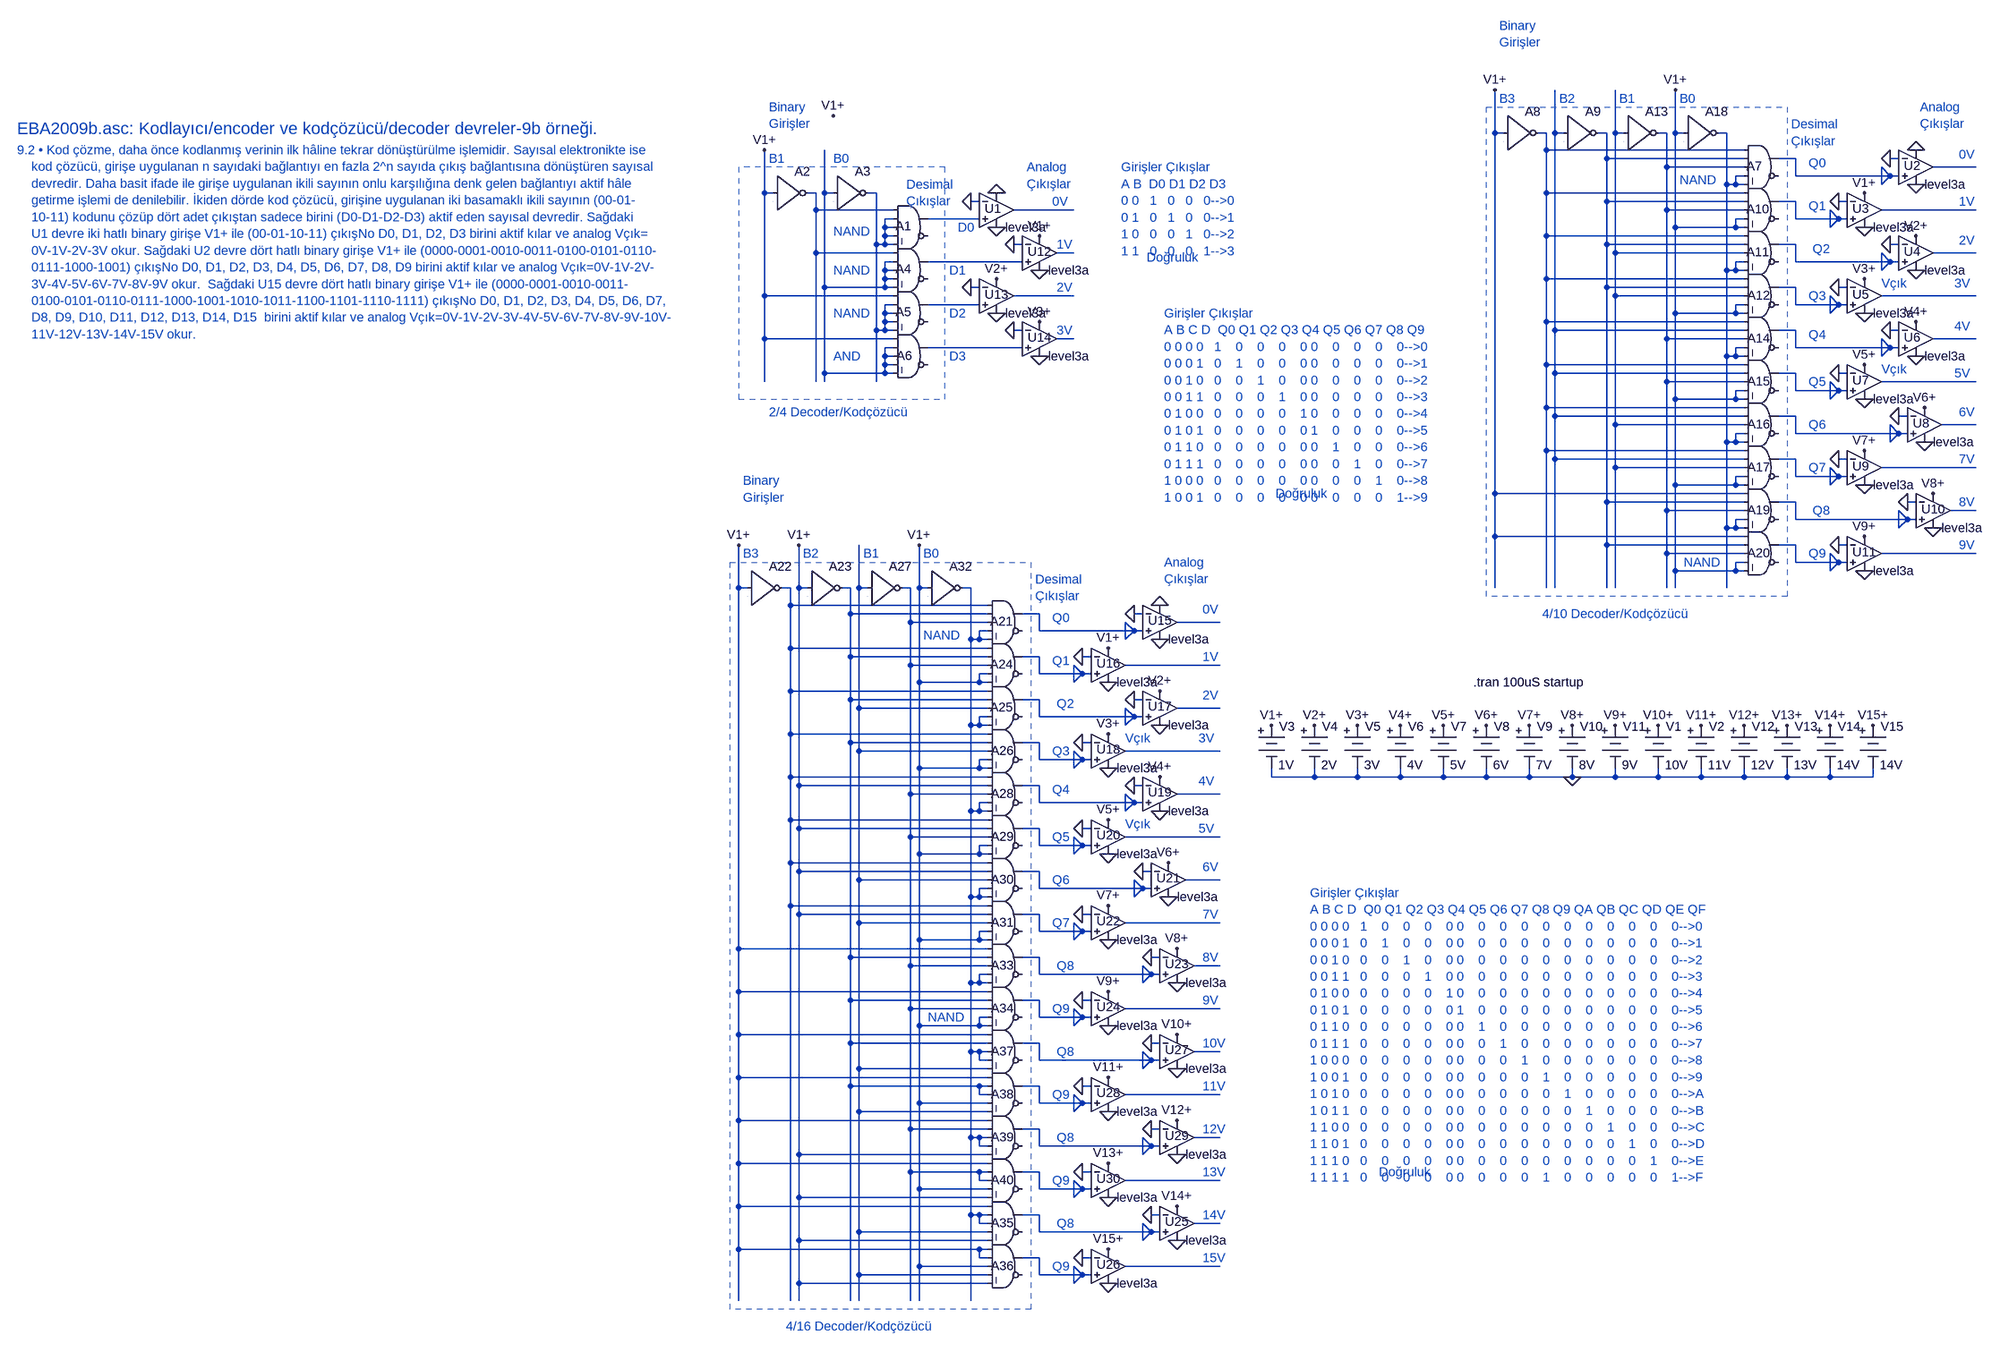
[diagram p0: schematic EBA2009b.asc]
EBA2009b.asc, the LTspice schematic file:
Version 4
SHEET 1 7064 4332
WIRE 2768 64 2768 -16
WIRE 2784 64 2768 64
WIRE 2864 64 2848 64
WIRE 2880 64 2880 -16
WIRE 2896 64 2880 64
WIRE 2976 64 2960 64
WIRE 2992 64 2992 -16
WIRE 3008 64 2992 64
WIRE 3088 64 3072 64
WIRE 3104 64 3104 -16
WIRE 3120 64 3104 64
WIRE 3200 64 3184 64
WIRE 2864 96 2864 64
WIRE 3232 96 2864 96
WIRE 2976 112 2976 64
WIRE 3232 112 2976 112
WIRE 3328 112 3296 112
WIRE 3520 112 3504 112
WIRE 3088 128 3088 64
WIRE 3232 128 3088 128
WIRE 3664 128 3584 128
WIRE 3232 144 3216 144
WIRE 3328 144 3328 112
WIRE 3504 144 3488 128
WIRE 3504 144 3328 144
WIRE 3520 144 3504 144
WIRE 3200 160 3200 64
WIRE 3216 160 3216 144
WIRE 3216 160 3200 160
WIRE 3232 160 3216 160
WIRE 3488 160 3488 128
WIRE 3488 160 3504 144
WIRE 1408 176 1408 96
WIRE 1424 176 1408 176
WIRE 1504 176 1488 176
WIRE 1520 176 1520 96
WIRE 1536 176 1520 176
WIRE 1616 176 1600 176
WIRE 2864 176 2864 96
WIRE 3232 176 2864 176
WIRE 1808 192 1792 192
WIRE 2976 192 2976 112
WIRE 3232 192 2976 192
WIRE 3328 192 3296 192
WIRE 3424 192 3408 192
WIRE 1504 208 1504 176
WIRE 1648 208 1504 208
WIRE 1984 208 1872 208
WIRE 3088 208 3088 128
WIRE 3232 208 3088 208
WIRE 3664 208 3488 208
WIRE 1648 224 1632 224
WIRE 1808 224 1712 224
WIRE 3232 224 3216 224
WIRE 3328 224 3328 192
WIRE 3408 224 3392 208
WIRE 3408 224 3328 224
WIRE 3424 224 3408 224
WIRE 1632 240 1632 224
WIRE 1648 240 1632 240
WIRE 3104 240 3104 64
WIRE 3216 240 3216 224
WIRE 3216 240 3104 240
WIRE 3232 240 3216 240
WIRE 3392 240 3392 208
WIRE 3392 240 3408 224
WIRE 1632 256 1632 240
WIRE 1648 256 1632 256
WIRE 2864 256 2864 176
WIRE 3232 256 2864 256
WIRE 1616 272 1616 176
WIRE 1632 272 1632 256
WIRE 1632 272 1616 272
WIRE 1648 272 1632 272
WIRE 1888 272 1872 272
WIRE 2976 272 2976 192
WIRE 3232 272 2976 272
WIRE 3328 272 3296 272
WIRE 3520 272 3504 272
WIRE 1504 288 1504 208
WIRE 1648 288 1504 288
WIRE 1984 288 1952 288
WIRE 2992 288 2992 64
WIRE 3232 288 2992 288
WIRE 3664 288 3584 288
WIRE 1648 304 1632 304
WIRE 1888 304 1712 304
WIRE 3232 304 3216 304
WIRE 3328 304 3328 272
WIRE 3504 304 3488 288
WIRE 3504 304 3328 304
WIRE 3520 304 3504 304
WIRE 1632 320 1632 304
WIRE 1648 320 1632 320
WIRE 3200 320 3200 160
WIRE 3216 320 3216 304
WIRE 3216 320 3200 320
WIRE 3232 320 3216 320
WIRE 3488 320 3488 288
WIRE 3488 320 3504 304
WIRE 1632 336 1632 320
WIRE 1648 336 1632 336
WIRE 2864 336 2864 256
WIRE 3232 336 2864 336
WIRE 1520 352 1520 176
WIRE 1632 352 1632 336
WIRE 1632 352 1520 352
WIRE 1648 352 1632 352
WIRE 1808 352 1792 352
WIRE 2976 352 2976 272
WIRE 3232 352 2976 352
WIRE 3328 352 3296 352
WIRE 3424 352 3408 352
WIRE 1408 368 1408 176
WIRE 1648 368 1408 368
WIRE 1984 368 1872 368
WIRE 2992 368 2992 288
WIRE 3232 368 2992 368
WIRE 3664 368 3488 368
WIRE 1648 384 1632 384
WIRE 1808 384 1712 384
WIRE 3232 384 3216 384
WIRE 3328 384 3328 352
WIRE 3408 384 3392 368
WIRE 3408 384 3328 384
WIRE 3424 384 3408 384
WIRE 1632 400 1632 384
WIRE 1648 400 1632 400
WIRE 3104 400 3104 240
WIRE 3216 400 3216 384
WIRE 3216 400 3104 400
WIRE 3232 400 3216 400
WIRE 3392 400 3392 368
WIRE 3392 400 3408 384
WIRE 1632 416 1632 400
WIRE 1648 416 1632 416
WIRE 2864 416 2864 336
WIRE 3232 416 2864 416
WIRE 1616 432 1616 272
WIRE 1632 432 1632 416
WIRE 1632 432 1616 432
WIRE 1648 432 1632 432
WIRE 1888 432 1872 432
WIRE 2880 432 2880 64
WIRE 3232 432 2880 432
WIRE 3328 432 3296 432
WIRE 3520 432 3504 432
WIRE 1408 448 1408 368
WIRE 1648 448 1408 448
WIRE 1984 448 1952 448
WIRE 3088 448 3088 208
WIRE 3232 448 3088 448
WIRE 3664 448 3584 448
WIRE 1648 464 1632 464
WIRE 1888 464 1712 464
WIRE 3232 464 3216 464
WIRE 3328 464 3328 432
WIRE 3504 464 3488 448
WIRE 3504 464 3328 464
WIRE 3520 464 3504 464
WIRE 1632 480 1632 464
WIRE 1648 480 1632 480
WIRE 3200 480 3200 320
WIRE 3216 480 3216 464
WIRE 3216 480 3200 480
WIRE 3232 480 3216 480
WIRE 3488 480 3488 448
WIRE 3488 480 3504 464
WIRE 1632 496 1632 480
WIRE 1648 496 1632 496
WIRE 2864 496 2864 416
WIRE 3232 496 2864 496
WIRE 1520 512 1520 352
WIRE 1632 512 1632 496
WIRE 1632 512 1520 512
WIRE 1648 512 1632 512
WIRE 2880 512 2880 432
WIRE 3232 512 2880 512
WIRE 3328 512 3296 512
WIRE 3424 512 3408 512
WIRE 1408 528 1408 448
WIRE 1504 528 1504 288
WIRE 1520 528 1520 512
WIRE 1616 528 1616 432
WIRE 3088 528 3088 448
WIRE 3232 528 3088 528
WIRE 3664 528 3488 528
WIRE 3232 544 3216 544
WIRE 3328 544 3328 512
WIRE 3408 544 3392 528
WIRE 3408 544 3328 544
WIRE 3424 544 3408 544
WIRE 3104 560 3104 400
WIRE 3216 560 3216 544
WIRE 3216 560 3104 560
WIRE 3232 560 3216 560
WIRE 3392 560 3392 528
WIRE 3392 560 3408 544
WIRE 2864 576 2864 496
WIRE 3232 576 2864 576
WIRE 2880 592 2880 512
WIRE 3232 592 2880 592
WIRE 3328 592 3296 592
WIRE 3536 592 3520 592
WIRE 2992 608 2992 368
WIRE 3232 608 2992 608
WIRE 3664 608 3600 608
WIRE 3232 624 3216 624
WIRE 3328 624 3328 592
WIRE 3520 624 3504 608
WIRE 3520 624 3328 624
WIRE 3536 624 3520 624
WIRE 3200 640 3200 480
WIRE 3216 640 3216 624
WIRE 3216 640 3200 640
WIRE 3232 640 3216 640
WIRE 3504 640 3504 608
WIRE 3504 640 3520 624
WIRE 2864 656 2864 576
WIRE 3232 656 2864 656
WIRE 2880 672 2880 592
WIRE 3232 672 2880 672
WIRE 3328 672 3296 672
WIRE 3424 672 3408 672
WIRE 2992 688 2992 608
WIRE 3232 688 2992 688
WIRE 3664 688 3488 688
WIRE 3232 704 3216 704
WIRE 3328 704 3328 672
WIRE 3408 704 3392 688
WIRE 3408 704 3328 704
WIRE 3424 704 3408 704
WIRE 3104 720 3104 560
WIRE 3216 720 3216 704
WIRE 3216 720 3104 720
WIRE 3232 720 3216 720
WIRE 3392 720 3392 688
WIRE 3392 720 3408 704
WIRE 2768 736 2768 64
WIRE 3232 736 2768 736
WIRE 2976 752 2976 352
WIRE 3232 752 2976 752
WIRE 3328 752 3296 752
WIRE 3552 752 3536 752
WIRE 3088 768 3088 528
WIRE 3232 768 3088 768
WIRE 3664 768 3616 768
WIRE 3232 784 3216 784
WIRE 3328 784 3328 752
WIRE 3536 784 3520 768
WIRE 3536 784 3328 784
WIRE 3552 784 3536 784
WIRE 3200 800 3200 640
WIRE 3216 800 3216 784
WIRE 3216 800 3200 800
WIRE 3232 800 3216 800
WIRE 3520 800 3520 768
WIRE 3520 800 3536 784
WIRE 2768 816 2768 736
WIRE 3232 816 2768 816
WIRE 2976 832 2976 752
WIRE 3232 832 2976 832
WIRE 3328 832 3296 832
WIRE 3424 832 3408 832
WIRE 3088 848 3088 768
WIRE 3232 848 3088 848
WIRE 3664 848 3488 848
WIRE 3232 864 3216 864
WIRE 3328 864 3328 832
WIRE 3408 864 3392 848
WIRE 3408 864 3328 864
WIRE 3424 864 3408 864
WIRE 3104 880 3104 720
WIRE 3216 880 3216 864
WIRE 3216 880 3104 880
WIRE 3232 880 3216 880
WIRE 3392 880 3392 848
WIRE 3392 880 3408 864
WIRE 1360 912 1360 832
WIRE 1376 912 1360 912
WIRE 1456 912 1440 912
WIRE 1472 912 1472 832
WIRE 1488 912 1472 912
WIRE 1568 912 1552 912
WIRE 1584 912 1584 832
WIRE 1600 912 1584 912
WIRE 1680 912 1664 912
WIRE 1696 912 1696 832
WIRE 1712 912 1696 912
WIRE 1792 912 1776 912
WIRE 2768 912 2768 816
WIRE 2864 912 2864 656
WIRE 2880 912 2880 672
WIRE 2976 912 2976 832
WIRE 2992 912 2992 688
WIRE 3088 912 3088 848
WIRE 3104 912 3104 880
WIRE 3200 912 3200 800
WIRE 1456 944 1456 912
WIRE 1824 944 1456 944
WIRE 1568 960 1568 912
WIRE 1824 960 1568 960
WIRE 1920 960 1888 960
WIRE 2112 960 2096 960
WIRE 1680 976 1680 912
WIRE 1824 976 1680 976
WIRE 2256 976 2176 976
WIRE 1824 992 1808 992
WIRE 1920 992 1920 960
WIRE 2096 992 2080 976
WIRE 2096 992 1920 992
WIRE 2112 992 2096 992
WIRE 1792 1008 1792 912
WIRE 1808 1008 1808 992
WIRE 1808 1008 1792 1008
WIRE 1824 1008 1808 1008
WIRE 2080 1008 2080 976
WIRE 2080 1008 2096 992
WIRE 1456 1024 1456 944
WIRE 1824 1024 1456 1024
WIRE 1568 1040 1568 960
WIRE 1824 1040 1568 1040
WIRE 1920 1040 1888 1040
WIRE 2016 1040 2000 1040
WIRE 1680 1056 1680 976
WIRE 1824 1056 1680 1056
WIRE 2256 1056 2080 1056
WIRE 1824 1072 1808 1072
WIRE 1920 1072 1920 1040
WIRE 2000 1072 1984 1056
WIRE 2000 1072 1920 1072
WIRE 2016 1072 2000 1072
WIRE 1696 1088 1696 912
WIRE 1808 1088 1808 1072
WIRE 1808 1088 1696 1088
WIRE 1824 1088 1808 1088
WIRE 1984 1088 1984 1056
WIRE 1984 1088 2000 1072
WIRE 1456 1104 1456 1024
WIRE 1824 1104 1456 1104
WIRE 1568 1120 1568 1040
WIRE 1824 1120 1568 1120
WIRE 1920 1120 1888 1120
WIRE 2112 1120 2096 1120
WIRE 1584 1136 1584 912
WIRE 1824 1136 1584 1136
WIRE 2256 1136 2176 1136
WIRE 1824 1152 1808 1152
WIRE 1920 1152 1920 1120
WIRE 2096 1152 2080 1136
WIRE 2096 1152 1920 1152
WIRE 2112 1152 2096 1152
WIRE 1792 1168 1792 1008
WIRE 1808 1168 1808 1152
WIRE 1808 1168 1792 1168
WIRE 1824 1168 1808 1168
WIRE 2080 1168 2080 1136
WIRE 2080 1168 2096 1152
WIRE 1456 1184 1456 1104
WIRE 1824 1184 1456 1184
WIRE 1568 1200 1568 1120
WIRE 1824 1200 1568 1200
WIRE 1920 1200 1888 1200
WIRE 2016 1200 2000 1200
WIRE 1584 1216 1584 1136
WIRE 1824 1216 1584 1216
WIRE 2256 1216 2080 1216
WIRE 1824 1232 1808 1232
WIRE 1920 1232 1920 1200
WIRE 2000 1232 1984 1216
WIRE 2000 1232 1920 1232
WIRE 2016 1232 2000 1232
WIRE 1696 1248 1696 1088
WIRE 1808 1248 1808 1232
WIRE 1808 1248 1696 1248
WIRE 1824 1248 1808 1248
WIRE 1984 1248 1984 1216
WIRE 1984 1248 2000 1232
WIRE 1456 1264 1456 1184
WIRE 1824 1264 1456 1264
WIRE 2352 1264 2352 1248
WIRE 2432 1264 2432 1248
WIRE 2432 1264 2352 1264
WIRE 2512 1264 2512 1248
WIRE 2512 1264 2432 1264
WIRE 2592 1264 2592 1248
WIRE 2592 1264 2512 1264
WIRE 2672 1264 2672 1248
WIRE 2672 1264 2592 1264
WIRE 2752 1264 2752 1248
WIRE 2752 1264 2672 1264
WIRE 2832 1264 2832 1248
WIRE 2832 1264 2752 1264
WIRE 2912 1264 2912 1248
WIRE 2912 1264 2832 1264
WIRE 2992 1264 2992 1248
WIRE 2992 1264 2912 1264
WIRE 3072 1264 3072 1248
WIRE 3072 1264 2992 1264
WIRE 3152 1264 3152 1248
WIRE 3152 1264 3072 1264
WIRE 3232 1264 3232 1248
WIRE 3232 1264 3152 1264
WIRE 3312 1264 3312 1248
WIRE 3312 1264 3232 1264
WIRE 3392 1264 3392 1248
WIRE 3392 1264 3312 1264
WIRE 3472 1264 3472 1248
WIRE 3472 1264 3392 1264
WIRE 1472 1280 1472 912
WIRE 1824 1280 1472 1280
WIRE 1920 1280 1888 1280
WIRE 2112 1280 2096 1280
WIRE 1680 1296 1680 1056
WIRE 1824 1296 1680 1296
WIRE 2256 1296 2176 1296
WIRE 1824 1312 1808 1312
WIRE 1920 1312 1920 1280
WIRE 2096 1312 2080 1296
WIRE 2096 1312 1920 1312
WIRE 2112 1312 2096 1312
WIRE 1792 1328 1792 1168
WIRE 1808 1328 1808 1312
WIRE 1808 1328 1792 1328
WIRE 1824 1328 1808 1328
WIRE 2080 1328 2080 1296
WIRE 2080 1328 2096 1312
WIRE 1456 1344 1456 1264
WIRE 1824 1344 1456 1344
WIRE 1472 1360 1472 1280
WIRE 1824 1360 1472 1360
WIRE 1920 1360 1888 1360
WIRE 2016 1360 2000 1360
WIRE 1680 1376 1680 1296
WIRE 1824 1376 1680 1376
WIRE 2256 1376 2080 1376
WIRE 1824 1392 1808 1392
WIRE 1920 1392 1920 1360
WIRE 2000 1392 1984 1376
WIRE 2000 1392 1920 1392
WIRE 2016 1392 2000 1392
WIRE 1696 1408 1696 1248
WIRE 1808 1408 1808 1392
WIRE 1808 1408 1696 1408
WIRE 1824 1408 1808 1408
WIRE 1984 1408 1984 1376
WIRE 1984 1408 2000 1392
WIRE 1456 1424 1456 1344
WIRE 1824 1424 1456 1424
WIRE 1472 1440 1472 1360
WIRE 1824 1440 1472 1440
WIRE 1920 1440 1888 1440
WIRE 2128 1440 2112 1440
WIRE 1584 1456 1584 1216
WIRE 1824 1456 1584 1456
WIRE 2256 1456 2192 1456
WIRE 1824 1472 1808 1472
WIRE 1920 1472 1920 1440
WIRE 2112 1472 2096 1456
WIRE 2112 1472 1920 1472
WIRE 2128 1472 2112 1472
WIRE 1792 1488 1792 1328
WIRE 1808 1488 1808 1472
WIRE 1808 1488 1792 1488
WIRE 1824 1488 1808 1488
WIRE 2096 1488 2096 1456
WIRE 2096 1488 2112 1472
WIRE 1456 1504 1456 1424
WIRE 1824 1504 1456 1504
WIRE 1472 1520 1472 1440
WIRE 1824 1520 1472 1520
WIRE 1920 1520 1888 1520
WIRE 2016 1520 2000 1520
WIRE 1584 1536 1584 1456
WIRE 1824 1536 1584 1536
WIRE 2256 1536 2080 1536
WIRE 1824 1552 1808 1552
WIRE 1920 1552 1920 1520
WIRE 2000 1552 1984 1536
WIRE 2000 1552 1920 1552
WIRE 2016 1552 2000 1552
WIRE 1696 1568 1696 1408
WIRE 1808 1568 1808 1552
WIRE 1808 1568 1696 1568
WIRE 1824 1568 1808 1568
WIRE 1984 1568 1984 1536
WIRE 1984 1568 2000 1552
WIRE 1360 1584 1360 912
WIRE 1824 1584 1360 1584
WIRE 1568 1600 1568 1200
WIRE 1824 1600 1568 1600
WIRE 1920 1600 1888 1600
WIRE 2144 1600 2128 1600
WIRE 1680 1616 1680 1376
WIRE 1824 1616 1680 1616
WIRE 2256 1616 2208 1616
WIRE 1824 1632 1808 1632
WIRE 1920 1632 1920 1600
WIRE 2128 1632 2112 1616
WIRE 2128 1632 1920 1632
WIRE 2144 1632 2128 1632
WIRE 1792 1648 1792 1488
WIRE 1808 1648 1808 1632
WIRE 1808 1648 1792 1648
WIRE 1824 1648 1808 1648
WIRE 2112 1648 2112 1616
WIRE 2112 1648 2128 1632
WIRE 1360 1664 1360 1584
WIRE 1824 1664 1360 1664
WIRE 1568 1680 1568 1600
WIRE 1824 1680 1568 1680
WIRE 1920 1680 1888 1680
WIRE 2016 1680 2000 1680
WIRE 1680 1696 1680 1616
WIRE 1824 1696 1680 1696
WIRE 2256 1696 2080 1696
WIRE 1824 1712 1808 1712
WIRE 1920 1712 1920 1680
WIRE 2000 1712 1984 1696
WIRE 2000 1712 1920 1712
WIRE 2016 1712 2000 1712
WIRE 1696 1728 1696 1568
WIRE 1808 1728 1808 1712
WIRE 1808 1728 1696 1728
WIRE 1824 1728 1808 1728
WIRE 1984 1728 1984 1696
WIRE 1984 1728 2000 1712
WIRE 1360 1744 1360 1664
WIRE 1824 1744 1360 1744
WIRE 1568 1760 1568 1680
WIRE 1824 1760 1568 1760
WIRE 1920 1760 1888 1760
WIRE 2144 1760 2128 1760
WIRE 1792 1776 1792 1648
WIRE 1808 1776 1792 1776
WIRE 1824 1776 1808 1776
WIRE 2256 1776 2208 1776
WIRE 1808 1792 1808 1776
WIRE 1824 1792 1808 1792
WIRE 1920 1792 1920 1760
WIRE 2128 1792 2112 1776
WIRE 2128 1792 1920 1792
WIRE 2144 1792 2128 1792
WIRE 1584 1808 1584 1536
WIRE 1824 1808 1584 1808
WIRE 2112 1808 2112 1776
WIRE 2112 1808 2128 1792
WIRE 1360 1824 1360 1744
WIRE 1824 1824 1360 1824
WIRE 1568 1840 1568 1760
WIRE 1808 1840 1568 1840
WIRE 1824 1840 1808 1840
WIRE 1920 1840 1888 1840
WIRE 2016 1840 2000 1840
WIRE 1808 1856 1808 1840
WIRE 1824 1856 1808 1856
WIRE 2256 1856 2080 1856
WIRE 1696 1872 1696 1728
WIRE 1824 1872 1696 1872
WIRE 1920 1872 1920 1840
WIRE 2000 1872 1984 1856
WIRE 2000 1872 1920 1872
WIRE 2016 1872 2000 1872
WIRE 1584 1888 1584 1808
WIRE 1824 1888 1584 1888
WIRE 1984 1888 1984 1856
WIRE 1984 1888 2000 1872
WIRE 1360 1904 1360 1824
WIRE 1824 1904 1360 1904
WIRE 1680 1920 1680 1696
WIRE 1824 1920 1680 1920
WIRE 1920 1920 1888 1920
WIRE 2144 1920 2128 1920
WIRE 1792 1936 1792 1776
WIRE 1808 1936 1792 1936
WIRE 1824 1936 1808 1936
WIRE 2256 1936 2208 1936
WIRE 1808 1952 1808 1936
WIRE 1824 1952 1808 1952
WIRE 1920 1952 1920 1920
WIRE 2128 1952 2112 1936
WIRE 2128 1952 1920 1952
WIRE 2144 1952 2128 1952
WIRE 1472 1968 1472 1520
WIRE 1824 1968 1472 1968
WIRE 2112 1968 2112 1936
WIRE 2112 1968 2128 1952
WIRE 1360 1984 1360 1904
WIRE 1824 1984 1360 1984
WIRE 1680 2000 1680 1920
WIRE 1808 2000 1680 2000
WIRE 1824 2000 1808 2000
WIRE 1920 2000 1888 2000
WIRE 2016 2000 2000 2000
WIRE 1808 2016 1808 2000
WIRE 1824 2016 1808 2016
WIRE 2256 2016 2080 2016
WIRE 1696 2032 1696 1872
WIRE 1824 2032 1696 2032
WIRE 1920 2032 1920 2000
WIRE 2000 2032 1984 2016
WIRE 2000 2032 1920 2032
WIRE 2016 2032 2000 2032
WIRE 1472 2048 1472 1968
WIRE 1824 2048 1472 2048
WIRE 1984 2048 1984 2016
WIRE 1984 2048 2000 2032
WIRE 1360 2064 1360 1984
WIRE 1824 2064 1360 2064
WIRE 1792 2080 1792 1936
WIRE 1808 2080 1792 2080
WIRE 1824 2080 1808 2080
WIRE 1920 2080 1888 2080
WIRE 2144 2080 2128 2080
WIRE 1808 2096 1808 2080
WIRE 1824 2096 1808 2096
WIRE 2256 2096 2208 2096
WIRE 1584 2112 1584 1888
WIRE 1824 2112 1584 2112
WIRE 1920 2112 1920 2080
WIRE 2128 2112 2112 2096
WIRE 2128 2112 1920 2112
WIRE 2144 2112 2128 2112
WIRE 1472 2128 1472 2048
WIRE 1824 2128 1472 2128
WIRE 2112 2128 2112 2096
WIRE 2112 2128 2128 2112
WIRE 1360 2144 1360 2064
WIRE 1808 2144 1360 2144
WIRE 1824 2144 1808 2144
WIRE 1808 2160 1808 2144
WIRE 1824 2160 1808 2160
WIRE 1920 2160 1888 2160
WIRE 2016 2160 2000 2160
WIRE 1696 2176 1696 2032
WIRE 1824 2176 1696 2176
WIRE 2256 2176 2080 2176
WIRE 1584 2192 1584 2112
WIRE 1824 2192 1584 2192
WIRE 1920 2192 1920 2160
WIRE 2000 2192 1984 2176
WIRE 2000 2192 1920 2192
WIRE 2016 2192 2000 2192
WIRE 1472 2208 1472 2128
WIRE 1824 2208 1472 2208
WIRE 1984 2208 1984 2176
WIRE 1984 2208 2000 2192
WIRE 1360 2240 1360 2144
WIRE 1456 2240 1456 1504
WIRE 1472 2240 1472 2208
WIRE 1568 2240 1568 1840
WIRE 1584 2240 1584 2192
WIRE 1680 2240 1680 2000
WIRE 1696 2240 1696 2176
WIRE 1792 2240 1792 2080
FLAG 1536 32 V1+
FLAG 1792 192 0
FLAG 1840 240 0
FLAG 2768 -16 V1+
FLAG 3504 112 0
FLAG 3552 160 0
FLAG 3104 -16 V1+
FLAG 3408 192 0
FLAG 3456 240 0
FLAG 3504 272 0
FLAG 3552 320 0
FLAG 3408 352 0
FLAG 3456 400 0
FLAG 3504 432 0
FLAG 3552 480 0
FLAG 3408 512 0
FLAG 3456 560 0
FLAG 3520 592 0
FLAG 3568 640 0
FLAG 3408 672 0
FLAG 3456 720 0
FLAG 3536 752 0
FLAG 3584 800 0
FLAG 3408 832 0
FLAG 3456 880 0
FLAG 3552 96 0
FLAG 3456 176 V1+
FLAG 3552 256 V2+
FLAG 3456 336 V3+
FLAG 3552 416 V4+
FLAG 3456 496 V5+
FLAG 3568 576 V6+
FLAG 3456 656 V7+
FLAG 3584 736 V8+
FLAG 3456 816 V9+
FLAG 1408 96 V1+
FLAG 2352 1168 V1+
FLAG 2432 1168 V2+
FLAG 2512 1168 V3+
FLAG 2592 1168 V4+
FLAG 2672 1168 V5+
FLAG 2752 1168 V6+
FLAG 2832 1168 V7+
FLAG 2912 1168 V8+
FLAG 2992 1168 V9+
FLAG 2912 1264 0
FLAG 1840 176 0
FLAG 1872 272 0
FLAG 1920 320 0
FLAG 1792 352 0
FLAG 1840 400 0
FLAG 1840 336 V2+
FLAG 1872 432 0
FLAG 1920 480 0
FLAG 1920 416 V3+
FLAG 1920 256 V1+
FLAG 1360 832 V1+
FLAG 2096 960 0
FLAG 2144 1008 0
FLAG 1696 832 V1+
FLAG 2000 1040 0
FLAG 2048 1088 0
FLAG 2096 1120 0
FLAG 2144 1168 0
FLAG 2000 1200 0
FLAG 2048 1248 0
FLAG 2096 1280 0
FLAG 2144 1328 0
FLAG 2000 1360 0
FLAG 2048 1408 0
FLAG 2112 1440 0
FLAG 2160 1488 0
FLAG 2000 1520 0
FLAG 2048 1568 0
FLAG 2128 1600 0
FLAG 2176 1648 0
FLAG 2000 1680 0
FLAG 2048 1728 0
FLAG 2144 944 0
FLAG 2048 1024 V1+
FLAG 2144 1104 V2+
FLAG 2048 1184 V3+
FLAG 2144 1264 V4+
FLAG 2048 1344 V5+
FLAG 2160 1424 V6+
FLAG 2048 1504 V7+
FLAG 2176 1584 V8+
FLAG 2048 1664 V9+
FLAG 2128 2080 0
FLAG 2176 2128 0
FLAG 2000 2160 0
FLAG 2048 2208 0
FLAG 2176 2064 V14+
FLAG 2048 2144 V15+
FLAG 2128 1760 0
FLAG 2176 1808 0
FLAG 2000 1840 0
FLAG 2048 1888 0
FLAG 2176 1744 V10+
FLAG 2048 1824 V11+
FLAG 2128 1920 0
FLAG 2176 1968 0
FLAG 2000 2000 0
FLAG 2048 2048 0
FLAG 2176 1904 V12+
FLAG 2048 1984 V13+
FLAG 1472 832 V1+
FLAG 3072 1168 V10+
FLAG 3152 1168 V11+
FLAG 3232 1168 V12+
FLAG 3312 1168 V13+
FLAG 3392 1168 V14+
FLAG 3472 1168 V15+
SYMBOL Digital\\and 1680 176 R0
WINDOW 0 -28 62 Left 2
SYMATTR InstName A1
SYMBOL Digital\\inv 1424 112 R0
SYMATTR InstName A2
SYMBOL Digital\\inv 1536 112 R0
SYMATTR InstName A3
SYMBOL Digital\\and 1680 256 R0
WINDOW 0 -28 62 Left 2
SYMATTR InstName A4
SYMBOL Digital\\and 1680 336 R0
WINDOW 0 -28 62 Left 2
SYMATTR InstName A5
SYMBOL Digital\\and 1680 416 R0
WINDOW 0 -26 63 Left 2
SYMATTR InstName A6
SYMBOL OpAmps\\UniversalOpAmp3 1840 208 R0
WINDOW 0 -22 -3 Left 2
SYMATTR InstName U1
SYMBOL Digital\\and 3264 64 R0
WINDOW 0 -28 62 Left 2
SYMATTR InstName A7
SYMBOL Digital\\inv 2784 0 R0
SYMATTR InstName A8
SYMBOL Digital\\inv 2896 0 R0
SYMATTR InstName A9
SYMBOL Digital\\and 3264 144 R0
WINDOW 0 -28 62 Left 2
SYMATTR InstName A10
SYMBOL Digital\\and 3264 224 R0
WINDOW 0 -28 62 Left 2
SYMATTR InstName A11
SYMBOL Digital\\and 3264 304 R0
WINDOW 0 -26 63 Left 2
SYMATTR InstName A12
SYMBOL OpAmps\\UniversalOpAmp3 3552 128 R0
WINDOW 0 -22 -3 Left 2
SYMATTR InstName U2
SYMBOL Digital\\inv 3008 0 R0
SYMATTR InstName A13
SYMBOL Digital\\and 3264 384 R0
WINDOW 0 -26 63 Left 2
SYMATTR InstName A14
SYMBOL Digital\\and 3264 464 R0
WINDOW 0 -26 63 Left 2
SYMATTR InstName A15
SYMBOL Digital\\and 3264 544 R0
WINDOW 0 -26 63 Left 2
SYMATTR InstName A16
SYMBOL Digital\\and 3264 624 R0
WINDOW 0 -26 63 Left 2
SYMATTR InstName A17
SYMBOL Digital\\inv 3120 0 R0
SYMATTR InstName A18
SYMBOL Digital\\and 3264 704 R0
WINDOW 0 -26 63 Left 2
SYMATTR InstName A19
SYMBOL Digital\\and 3264 784 R0
WINDOW 0 -26 63 Left 2
SYMATTR InstName A20
SYMBOL OpAmps\\UniversalOpAmp3 3456 208 R0
WINDOW 0 -22 -3 Left 2
SYMATTR InstName U3
SYMBOL OpAmps\\UniversalOpAmp3 3552 288 R0
WINDOW 0 -22 -3 Left 2
SYMATTR InstName U4
SYMBOL OpAmps\\UniversalOpAmp3 3456 368 R0
WINDOW 0 -22 -3 Left 2
SYMATTR InstName U5
SYMBOL OpAmps\\UniversalOpAmp3 3552 448 R0
WINDOW 0 -22 -3 Left 2
SYMATTR InstName U6
SYMBOL OpAmps\\UniversalOpAmp3 3456 528 R0
WINDOW 0 -22 -3 Left 2
SYMATTR InstName U7
SYMBOL OpAmps\\UniversalOpAmp3 3568 608 R0
WINDOW 0 -22 -3 Left 2
SYMATTR InstName U8
SYMBOL OpAmps\\UniversalOpAmp3 3456 688 R0
WINDOW 0 -22 -3 Left 2
SYMATTR InstName U9
SYMBOL OpAmps\\UniversalOpAmp3 3584 768 R0
WINDOW 0 -22 -3 Left 2
SYMATTR InstName U10
SYMBOL OpAmps\\UniversalOpAmp3 3456 848 R0
WINDOW 0 -22 -3 Left 2
SYMATTR InstName U11
SYMBOL Misc\\battery 2352 1152 R0
WINDOW 0 14 18 Left 2
WINDOW 3 13 90 Left 2
SYMATTR InstName V3
SYMATTR Value 1V
SYMBOL Misc\\battery 2432 1152 R0
WINDOW 0 14 18 Left 2
WINDOW 3 13 90 Left 2
WINDOW 123 0 0 Left 0
WINDOW 39 0 0 Left 0
SYMATTR InstName V4
SYMATTR Value 2V
SYMBOL Misc\\battery 2512 1152 R0
WINDOW 0 14 18 Left 2
WINDOW 3 13 90 Left 2
SYMATTR InstName V5
SYMATTR Value 3V
SYMBOL Misc\\battery 2592 1152 R0
WINDOW 0 14 18 Left 2
WINDOW 3 13 90 Left 2
SYMATTR InstName V6
SYMATTR Value 4V
SYMBOL Misc\\battery 2672 1152 R0
WINDOW 0 14 18 Left 2
WINDOW 3 13 90 Left 2
SYMATTR InstName V7
SYMATTR Value 5V
SYMBOL Misc\\battery 2752 1152 R0
WINDOW 0 14 18 Left 2
WINDOW 3 13 90 Left 2
SYMATTR InstName V8
SYMATTR Value 6V
SYMBOL Misc\\battery 2832 1152 R0
WINDOW 0 14 18 Left 2
WINDOW 3 13 90 Left 2
SYMATTR InstName V9
SYMATTR Value 7V
SYMBOL Misc\\battery 2912 1152 R0
WINDOW 0 14 18 Left 2
WINDOW 3 13 90 Left 2
SYMATTR InstName V10
SYMATTR Value 8V
SYMBOL Misc\\battery 2992 1152 R0
WINDOW 0 14 18 Left 2
WINDOW 3 13 90 Left 2
SYMATTR InstName V11
SYMATTR Value 9V
SYMBOL OpAmps\\UniversalOpAmp3 1920 288 R0
WINDOW 0 -22 -3 Left 2
SYMATTR InstName U12
SYMBOL OpAmps\\UniversalOpAmp3 1840 368 R0
WINDOW 0 -22 -3 Left 2
SYMATTR InstName U13
SYMBOL OpAmps\\UniversalOpAmp3 1920 448 R0
WINDOW 0 -22 -3 Left 2
SYMATTR InstName U14
SYMBOL Digital\\and 1856 912 R0
WINDOW 0 -28 62 Left 2
SYMATTR InstName A21
SYMBOL Digital\\inv 1376 848 R0
SYMATTR InstName A22
SYMBOL Digital\\inv 1488 848 R0
SYMATTR InstName A23
SYMBOL Digital\\and 1856 992 R0
WINDOW 0 -28 62 Left 2
SYMATTR InstName A24
SYMBOL Digital\\and 1856 1072 R0
WINDOW 0 -28 62 Left 2
SYMATTR InstName A25
SYMBOL Digital\\and 1856 1152 R0
WINDOW 0 -26 63 Left 2
SYMATTR InstName A26
SYMBOL OpAmps\\UniversalOpAmp3 2144 976 R0
WINDOW 0 -22 -3 Left 2
SYMATTR InstName U15
SYMBOL Digital\\inv 1600 848 R0
SYMATTR InstName A27
SYMBOL Digital\\and 1856 1232 R0
WINDOW 0 -26 63 Left 2
SYMATTR InstName A28
SYMBOL Digital\\and 1856 1312 R0
WINDOW 0 -26 63 Left 2
SYMATTR InstName A29
SYMBOL Digital\\and 1856 1392 R0
WINDOW 0 -26 63 Left 2
SYMATTR InstName A30
SYMBOL Digital\\and 1856 1472 R0
WINDOW 0 -26 63 Left 2
SYMATTR InstName A31
SYMBOL Digital\\inv 1712 848 R0
SYMATTR InstName A32
SYMBOL Digital\\and 1856 1552 R0
WINDOW 0 -26 63 Left 2
SYMATTR InstName A33
SYMBOL Digital\\and 1856 1632 R0
WINDOW 0 -26 63 Left 2
SYMATTR InstName A34
SYMBOL OpAmps\\UniversalOpAmp3 2048 1056 R0
WINDOW 0 -22 -3 Left 2
SYMATTR InstName U16
SYMBOL OpAmps\\UniversalOpAmp3 2144 1136 R0
WINDOW 0 -22 -3 Left 2
SYMATTR InstName U17
SYMBOL OpAmps\\UniversalOpAmp3 2048 1216 R0
WINDOW 0 -22 -3 Left 2
SYMATTR InstName U18
SYMBOL OpAmps\\UniversalOpAmp3 2144 1296 R0
WINDOW 0 -22 -3 Left 2
SYMATTR InstName U19
SYMBOL OpAmps\\UniversalOpAmp3 2048 1376 R0
WINDOW 0 -22 -3 Left 2
SYMATTR InstName U20
SYMBOL OpAmps\\UniversalOpAmp3 2160 1456 R0
WINDOW 0 -22 -3 Left 2
SYMATTR InstName U21
SYMBOL OpAmps\\UniversalOpAmp3 2048 1536 R0
WINDOW 0 -22 -3 Left 2
SYMATTR InstName U22
SYMBOL OpAmps\\UniversalOpAmp3 2176 1616 R0
WINDOW 0 -22 -3 Left 2
SYMATTR InstName U23
SYMBOL OpAmps\\UniversalOpAmp3 2048 1696 R0
WINDOW 0 -22 -3 Left 2
SYMATTR InstName U24
SYMBOL Digital\\and 1856 2032 R0
WINDOW 0 -26 63 Left 2
SYMATTR InstName A35
SYMBOL Digital\\and 1856 2112 R0
WINDOW 0 -26 63 Left 2
SYMATTR InstName A36
SYMBOL OpAmps\\UniversalOpAmp3 2176 2096 R0
WINDOW 0 -22 -3 Left 2
SYMATTR InstName U25
SYMBOL OpAmps\\UniversalOpAmp3 2048 2176 R0
WINDOW 0 -22 -3 Left 2
SYMATTR InstName U26
SYMBOL Digital\\and 1856 1712 R0
WINDOW 0 -26 63 Left 2
SYMATTR InstName A37
SYMBOL Digital\\and 1856 1792 R0
WINDOW 0 -26 63 Left 2
SYMATTR InstName A38
SYMBOL OpAmps\\UniversalOpAmp3 2176 1776 R0
WINDOW 0 -22 -3 Left 2
SYMATTR InstName U27
SYMBOL OpAmps\\UniversalOpAmp3 2048 1856 R0
WINDOW 0 -22 -3 Left 2
SYMATTR InstName U28
SYMBOL Digital\\and 1856 1872 R0
WINDOW 0 -26 63 Left 2
SYMATTR InstName A39
SYMBOL Digital\\and 1856 1952 R0
WINDOW 0 -26 63 Left 2
SYMATTR InstName A40
SYMBOL OpAmps\\UniversalOpAmp3 2176 1936 R0
WINDOW 0 -22 -3 Left 2
SYMATTR InstName U29
SYMBOL OpAmps\\UniversalOpAmp3 2048 2016 R0
WINDOW 0 -22 -3 Left 2
SYMATTR InstName U30
SYMBOL Misc\\battery 3072 1152 R0
WINDOW 0 14 18 Left 2
WINDOW 3 13 90 Left 2
SYMATTR InstName V1
SYMATTR Value 10V
SYMBOL Misc\\battery 3152 1152 R0
WINDOW 0 14 18 Left 2
WINDOW 3 13 90 Left 2
SYMATTR InstName V2
SYMATTR Value 11V
SYMBOL Misc\\battery 3232 1152 R0
WINDOW 0 14 18 Left 2
WINDOW 3 13 90 Left 2
SYMATTR InstName V12
SYMATTR Value 12V
SYMBOL Misc\\battery 3312 1152 R0
WINDOW 0 14 18 Left 2
WINDOW 3 13 90 Left 2
SYMATTR InstName V13
SYMATTR Value 13V
SYMBOL Misc\\battery 3392 1152 R0
WINDOW 0 14 18 Left 2
WINDOW 3 13 90 Left 2
SYMATTR InstName V14
SYMATTR Value 14V
SYMBOL Misc\\battery 3472 1152 R0
WINDOW 0 14 18 Left 2
WINDOW 3 13 90 Left 2
SYMATTR InstName V15
SYMATTR Value 14V
TEXT -232 56 Left 3 ;EBA2009b.asc: Kodlayıcı/encoder ve kodçözücü/decoder devreler-9b örneği.
TEXT -232 96 Left 2 ;9.2 • Kod çözme, daha önce kodlanmış verinin ilk hâline tekrar dönüştürülme işlemidir. Sayısal elektronikte ise\n    kod çözücü, girişe uygulanan n sayıdaki bağlantıyı en fazla 2^n sayıda çıkış bağlantısına dönüştüren sayısal\n    devredir. Daha basit ifade ile girişe uygulanan ikili sayının onlu karşılığına denk gelen bağlantıyı aktif hâle \n    getirme işlemi de denilebilir. İkiden dörde kod çözücü, girişine uygulanan iki basamaklı ikili sayının (00-01-\n    10-11) kodunu çözüp dört adet çıkıştan sadece birini (D0-D1-D2-D3) aktif eden sayısal devredir. Sağdaki\n    U1 devre iki hatlı binary girişe V1+ ile (00-01-10-11) çıkışNo D0, D1, D2, D3 birini aktif kılar ve analog Vçık=\n    0V-1V-2V-3V okur. Sağdaki U2 devre dört hatlı binary girişe V1+ ile (0000-0001-0010-0011-0100-0101-0110-\n    0111-1000-1001) çıkışNo D0, D1, D2, D3, D4, D5, D6, D7, D8, D9 birini aktif kılar ve analog Vçık=0V-1V-2V-\n    3V-4V-5V-6V-7V-8V-9V okur.  Sağdaki U15 devre dört hatlı binary girişe V1+ ile (0000-0001-0010-0011-\n    0100-0101-0110-0111-1000-1001-1010-1011-1100-1101-1110-1111) çıkışNo D0, D1, D2, D3, D4, D5, D6, D7,\n    D8, D9, D10, D11, D12, D13, D14, D15  birini aktif kılar ve analog Vçık=0V-1V-2V-3V-4V-5V-6V-7V-8V-9V-10V-\n    11V-12V-13V-14V-15V okur.
TEXT 2728 1088 Left 2 !.tran 100uS startup
TEXT 2072 128 Left 2 ;Girişler Çıkışlar\nA B  D0 D1 D2 D3\n0 0   1   0   0   0-->0\n0 1   0   1   0   0-->1\n1 0   0   0   1   0-->2\n1 1   0   0   0   1-->3
TEXT 2120 296 Left 2 ;Doğruluk
TEXT 1752 400 Left 2 ;D2
TEXT 1752 320 Left 2 ;D1
TEXT 1768 240 Left 2 ;D0
TEXT 1752 480 Left 2 ;D3
TEXT 1536 248 Left 2 ;NAND
TEXT 1536 320 Left 2 ;NAND
TEXT 1536 400 Left 2 ;NAND
TEXT 1536 480 Left 2 ;AND
TEXT 1416 584 Left 2 ;2/4 Decoder/Kodçözücü
TEXT 1416 16 Left 2 ;Binary\nGirişler
TEXT 1672 160 Left 2 ;Desimal\nÇıkışlar
TEXT 2152 400 Left 2 ;Girişler Çıkışlar\nA B C D  Q0 Q1 Q2 Q3 Q4 Q5 Q6 Q7 Q8 Q9\n0 0 0 0   1    0    0    0    0 0    0    0    0    0-->0\n0 0 0 1   0    1    0    0    0 0    0    0    0    0-->1\n0 0 1 0   0    0    1    0    0 0    0    0    0    0-->2\n0 0 1 1   0    0    0    1    0 0    0    0    0    0-->3\n0 1 0 0   0    0    0    0    1 0    0    0    0    0-->4\n0 1 0 1   0    0    0    0    0 1    0    0    0    0-->5\n0 1 1 0   0    0    0    0    0 0    1    0    0    0-->6\n0 1 1 1   0    0    0    0    0 0    0    1    0    0-->7\n1 0 0 0   0    0    0    0    0 0    0    0    1    0-->8\n1 0 0 1   0    0    0    0    0 0    0    0    0    1-->9
TEXT 3360 280 Left 2 ;Q2
TEXT 3352 200 Left 2 ;Q1
TEXT 3352 120 Left 2 ;Q0
TEXT 3352 368 Left 2 ;Q3
TEXT 2856 960 Left 2 ;4/10 Decoder/Kodçözücü
TEXT 2360 736 Left 2 ;Doğruluk
TEXT 2776 0 Left 2 ;B3
TEXT 2888 0 Left 2 ;B2
TEXT 3000 0 Left 2 ;B1
TEXT 3352 440 Left 2 ;Q4
TEXT 3352 528 Left 2 ;Q5
TEXT 3352 608 Left 2 ;Q6
TEXT 3352 688 Left 2 ;Q7
TEXT 3112 0 Left 2 ;B0
TEXT 3112 152 Left 2 ;NAND
TEXT 3360 768 Left 2 ;Q8
TEXT 3352 848 Left 2 ;Q9
TEXT 3488 344 Left 2 ;Vçık
TEXT 3488 504 Left 2 ;Vçık
TEXT 3120 864 Left 2 ;NAND
TEXT 3632 104 Left 2 ;0V
TEXT 3632 192 Left 2 ;1V
TEXT 3632 264 Left 2 ;2V
TEXT 3624 344 Left 2 ;3V
TEXT 3624 424 Left 2 ;4V
TEXT 3624 512 Left 2 ;5V
TEXT 3632 584 Left 2 ;6V
TEXT 3632 672 Left 2 ;7V
TEXT 3632 752 Left 2 ;8V
TEXT 3632 832 Left 2 ;9V
TEXT 1536 112 Left 2 ;B0
TEXT 1416 112 Left 2 ;B1
TEXT 1944 192 Left 2 ;0V
TEXT 1952 272 Left 2 ;1V
TEXT 1952 352 Left 2 ;2V
TEXT 1952 432 Left 2 ;3V
TEXT 3560 16 Left 2 ;Analog\nÇıkışlar
TEXT 3320 48 Left 2 ;Desimal\nÇıkışlar
TEXT 1896 128 Left 2 ;Analog\nÇıkışlar
TEXT 2776 -136 Left 2 ;Binary\nGirişler
TEXT 1952 1128 Left 2 ;Q2
TEXT 1944 1048 Left 2 ;Q1
TEXT 1944 968 Left 2 ;Q0
TEXT 1944 1216 Left 2 ;Q3
TEXT 1448 2288 Left 2 ;4/16 Decoder/Kodçözücü
TEXT 1368 848 Left 2 ;B3
TEXT 1480 848 Left 2 ;B2
TEXT 1592 848 Left 2 ;B1
TEXT 1944 1288 Left 2 ;Q4
TEXT 1944 1376 Left 2 ;Q5
TEXT 1944 1456 Left 2 ;Q6
TEXT 1944 1536 Left 2 ;Q7
TEXT 1704 848 Left 2 ;B0
TEXT 1704 1000 Left 2 ;NAND
TEXT 1952 1616 Left 2 ;Q8
TEXT 1944 1696 Left 2 ;Q9
TEXT 2080 1192 Left 2 ;Vçık
TEXT 2080 1352 Left 2 ;Vçık
TEXT 1712 1712 Left 2 ;NAND
TEXT 2224 952 Left 2 ;0V
TEXT 2224 1040 Left 2 ;1V
TEXT 2224 1112 Left 2 ;2V
TEXT 2216 1192 Left 2 ;3V
TEXT 2216 1272 Left 2 ;4V
TEXT 2216 1360 Left 2 ;5V
TEXT 2224 1432 Left 2 ;6V
TEXT 2224 1520 Left 2 ;7V
TEXT 2224 1600 Left 2 ;8V
TEXT 2224 1680 Left 2 ;9V
TEXT 2152 864 Left 2 ;Analog\nÇıkışlar
TEXT 1912 896 Left 2 ;Desimal\nÇıkışlar
TEXT 1368 712 Left 2 ;Binary\nGirişler
TEXT 1952 2096 Left 2 ;Q8
TEXT 1944 2176 Left 2 ;Q9
TEXT 2224 2080 Left 2 ;14V
TEXT 2224 2160 Left 2 ;15V
TEXT 1952 1776 Left 2 ;Q8
TEXT 1944 1856 Left 2 ;Q9
TEXT 2224 1760 Left 2 ;10V
TEXT 2224 1840 Left 2 ;11V
TEXT 1952 1936 Left 2 ;Q8
TEXT 1944 2016 Left 2 ;Q9
TEXT 2224 1920 Left 2 ;12V
TEXT 2224 2000 Left 2 ;13V
TEXT 2424 1480 Left 2 ;Girişler Çıkışlar\nA B C D  Q0 Q1 Q2 Q3 Q4 Q5 Q6 Q7 Q8 Q9 QA QB QC QD QE QF\n0 0 0 0   1    0    0    0    0 0    0    0    0    0    0    0    0    0    0    0-->0\n0 0 0 1   0    1    0    0    0 0    0    0    0    0    0    0    0    0    0    0-->1\n0 0 1 0   0    0    1    0    0 0    0    0    0    0    0    0    0    0    0    0-->2\n0 0 1 1   0    0    0    1    0 0    0    0    0    0    0    0    0    0    0    0-->3\n0 1 0 0   0    0    0    0    1 0    0    0    0    0    0    0    0    0    0    0-->4\n0 1 0 1   0    0    0    0    0 1    0    0    0    0    0    0    0    0    0    0-->5\n0 1 1 0   0    0    0    0    0 0    1    0    0    0    0    0    0    0    0    0-->6\n0 1 1 1   0    0    0    0    0 0    0    1    0    0    0    0    0    0    0    0-->7\n1 0 0 0   0    0    0    0    0 0    0    0    1    0    0    0    0    0    0    0-->8\n1 0 0 1   0    0    0    0    0 0    0    0    0    1    0    0    0    0    0    0-->9\n1 0 1 0   0    0    0    0    0 0    0    0    0    0    1    0    0    0    0    0-->A\n1 0 1 1   0    0    0    0    0 0    0    0    0    0    0    1    0    0    0    0-->B\n1 1 0 0   0    0    0    0    0 0    0    0    0    0    0    0    1    0    0    0-->C\n1 1 0 1   0    0    0    0    0 0    0    0    0    0    0    0    0    1    0    0-->D\n1 1 1 0   0    0    0    0    0 0    0    0    0    0    0    0    0    0    1    0-->E\n1 1 1 1   0    0    0    0    0 0    0    0    0    1    0    0    0    0    0    1-->F
TEXT 2552 2000 Left 2 ;Doğruluk
RECTANGLE Normal 1744 128 1360 560 2
RECTANGLE Normal 3312 928 2752 16 2
RECTANGLE Normal 1904 2256 1344 864 2

The netlist it stands for:
* EBA2009b.asc
A1 N009 N011 N011 N011 N011 0 N015 0 AND
A2 V1+ 0 0 0 0 N009 0 0 BUF
A3 N010 0 0 0 0 N011 0 0 BUF
A4 N009 N010 N010 N010 N010 0 N019 0 AND
A5 V1+ N011 N011 N011 N011 0 N023 0 AND
A6 V1+ N010 N010 N010 N010 0 N027 0 AND
XU1 N015 0 0 0 N013 level3a  ; pins In+ In- V+ V- OUT
A7 N001 N003 N005 N006 N006 0 N007 0 AND
A8 V1+ 0 0 0 0 N001 0 0 BUF
A9 N002 0 0 0 0 N003 0 0 BUF
A10 N001 N003 N005 V1+ V1+ 0 N012 0 AND
A11 N001 N003 N004 N006 N006 0 N016 0 AND
A12 N001 N003 N004 V1+ V1+ 0 N020 0 AND
XU2 N007 0 0 0 N008 level3a  ; pins In+ In- V+ V- OUT
A13 N004 0 0 0 0 N005 0 0 BUF
A14 N001 N002 N005 N006 N006 0 N024 0 AND
A15 N001 N002 N005 V1+ V1+ 0 N028 0 AND
A16 N001 N002 N004 N006 N006 0 N030 0 AND
A17 N001 N002 N004 V1+ V1+ 0 N032 0 AND
A18 V1+ 0 0 0 0 N006 0 0 BUF
A19 V1+ N003 N005 N006 N006 0 N034 0 AND
A20 V1+ N003 N005 V1+ V1+ 0 N036 0 AND
XU3 N012 0 V1+ 0 N014 level3a  ; pins In+ In- V+ V- OUT
XU4 N016 0 V2+ 0 N018 level3a  ; pins In+ In- V+ V- OUT
XU5 N020 0 V3+ 0 N022 level3a  ; pins In+ In- V+ V- OUT
XU6 N024 0 V4+ 0 N026 level3a  ; pins In+ In- V+ V- OUT
XU7 N028 0 V5+ 0 N029 level3a  ; pins In+ In- V+ V- OUT
XU8 N030 0 V6+ 0 N031 level3a  ; pins In+ In- V+ V- OUT
XU9 N032 0 V7+ 0 N033 level3a  ; pins In+ In- V+ V- OUT
XU10 N034 0 V8+ 0 N035 level3a  ; pins In+ In- V+ V- OUT
XU11 N036 0 V9+ 0 N037 level3a  ; pins In+ In- V+ V- OUT
V3 V1+ 0 1V
V4 V2+ 0 2V
V5 V3+ 0 3V
V6 V4+ 0 4V
V7 V5+ 0 5V
V8 V6+ 0 6V
V9 V7+ 0 7V
V10 V8+ 0 8V
V11 V9+ 0 9V
XU12 N019 0 V1+ 0 N017 level3a  ; pins In+ In- V+ V- OUT
XU13 N023 0 V2+ 0 N021 level3a  ; pins In+ In- V+ V- OUT
XU14 N027 0 V3+ 0 N025 level3a  ; pins In+ In- V+ V- OUT
A21 N038 N039 N041 N042 N042 0 N043 0 AND
A22 V1+ 0 0 0 0 N038 0 0 BUF
A23 V1+ 0 0 0 0 N039 0 0 BUF
A24 N038 N039 N041 V1+ V1+ 0 N045 0 AND
A25 N038 N039 N040 N042 N042 0 N047 0 AND
A26 N038 N039 N040 V1+ V1+ 0 N049 0 AND
XU15 N043 0 0 0 N044 level3a  ; pins In+ In- V+ V- OUT
A27 N040 0 0 0 0 N041 0 0 BUF
A28 N038 V1+ N041 N042 N042 0 N051 0 AND
A29 N038 V1+ N041 V1+ V1+ 0 N053 0 AND
A30 N038 V1+ N040 N042 N042 0 N055 0 AND
A31 N038 V1+ N040 V1+ V1+ 0 N057 0 AND
A32 V1+ 0 0 0 0 N042 0 0 BUF
A33 V1+ N039 N041 N042 N042 0 N059 0 AND
A34 V1+ N039 N041 V1+ V1+ 0 N061 0 AND
XU16 N045 0 V1+ 0 N046 level3a  ; pins In+ In- V+ V- OUT
XU17 N047 0 V2+ 0 N048 level3a  ; pins In+ In- V+ V- OUT
XU18 N049 0 V3+ 0 N050 level3a  ; pins In+ In- V+ V- OUT
XU19 N051 0 V4+ 0 N052 level3a  ; pins In+ In- V+ V- OUT
XU20 N053 0 V5+ 0 N054 level3a  ; pins In+ In- V+ V- OUT
XU21 N055 0 V6+ 0 N056 level3a  ; pins In+ In- V+ V- OUT
XU22 N057 0 V7+ 0 N058 level3a  ; pins In+ In- V+ V- OUT
XU23 N059 0 V8+ 0 N060 level3a  ; pins In+ In- V+ V- OUT
XU24 N061 0 V9+ 0 N062 level3a  ; pins In+ In- V+ V- OUT
A35 V1+ N042 N042 N040 V1+ 0 N071 0 AND
A36 V1+ V1+ V1+ N040 V1+ 0 N073 0 AND
XU25 N071 0 V14+ 0 N072 level3a  ; pins In+ In- V+ V- OUT
XU26 N073 0 V15+ 0 N074 level3a  ; pins In+ In- V+ V- OUT
A37 V1+ N039 N042 N042 N040 0 N063 0 AND
A38 V1+ N039 N039 V1+ N040 0 N065 0 AND
XU27 N063 0 V10+ 0 N064 level3a  ; pins In+ In- V+ V- OUT
XU28 N065 0 V11+ 0 N066 level3a  ; pins In+ In- V+ V- OUT
A39 V1+ N041 N042 N042 V1+ 0 N067 0 AND
A40 V1+ N041 N041 V1+ V1+ 0 N069 0 AND
XU29 N067 0 V12+ 0 N068 level3a  ; pins In+ In- V+ V- OUT
XU30 N069 0 V13+ 0 N070 level3a  ; pins In+ In- V+ V- OUT
V1 V10+ 0 10V
V2 V11+ 0 11V
V12 V12+ 0 12V
V13 V13+ 0 13V
V14 V14+ 0 14V
V15 V15+ 0 14V
* EBA2009b.asc: Kodlayıcı/encoder ve kodçözücü/decoder devreler-9b örneği.
* 9.2 • Kod çözme, daha önce kodlanmış verinin ilk hâline tekrar dönüştürülme işlemidir. Sayısal elektronikte ise
*     kod çözücü, girişe uygulanan n sayıdaki bağlantıyı en fazla 2^n sayıda çıkış bağlantısına dönüştüren sayısal
*     devredir. Daha basit ifade ile girişe uygulanan ikili sayının onlu karşılığına denk gelen bağlantıyı aktif hâle
*     getirme işlemi de denilebilir. İkiden dörde kod çözücü, girişine uygulanan iki basamaklı ikili sayının (00-01-
*     10-11) kodunu çözüp dört adet çıkıştan sadece birini (D0-D1-D2-D3) aktif eden sayısal devredir. Sağdaki
*     U1 devre iki hatlı binary girişe V1+ ile (00-01-10-11) çıkışNo D0, D1, D2, D3 birini aktif kılar ve analog Vçık=
*     0V-1V-2V-3V okur. Sağdaki U2 devre dört hatlı binary girişe V1+ ile (0000-0001-0010-0011-0100-0101-0110-
*     0111-1000-1001) çıkışNo D0, D1, D2, D3, D4, D5, D6, D7, D8, D9 birini aktif kılar ve analog Vçık=0V-1V-2V-
*     3V-4V-5V-6V-7V-8V-9V okur.  Sağdaki U15 devre dört hatlı binary girişe V1+ ile (0000-0001-0010-0011-
*     0100-0101-0110-0111-1000-1001-1010-1011-1100-1101-1110-1111) çıkışNo D0, D1, D2, D3, D4, D5, D6, D7,
*     D8, D9, D10, D11, D12, D13, D14, D15  birini aktif kılar ve analog Vçık=0V-1V-2V-3V-4V-5V-6V-7V-8V-9V-10V-
*     11V-12V-13V-14V-15V okur.
.tran 100uS startup
* Girişler Çıkışlar
* A B  D0 D1 D2 D3
* 0 0   1   0   0   0-->0
* 0 1   0   1   0   0-->1
* 1 0   0   0   1   0-->2
* 1 1   0   0   0   1-->3
* Doğruluk
* D2
* D1
* D0
* D3
* NAND
* NAND
* NAND
* AND
* 2/4 Decoder/Kodçözücü
* Binary
* Girişler
* Desimal
* Çıkışlar
* Girişler Çıkışlar
* A B C D  Q0 Q1 Q2 Q3 Q4 Q5 Q6 Q7 Q8 Q9
* 0 0 0 0   1    0    0    0    0 0    0    0    0    0-->0
* 0 0 0 1   0    1    0    0    0 0    0    0    0    0-->1
* 0 0 1 0   0    0    1    0    0 0    0    0    0    0-->2
* 0 0 1 1   0    0    0    1    0 0    0    0    0    0-->3
* 0 1 0 0   0    0    0    0    1 0    0    0    0    0-->4
* 0 1 0 1   0    0    0    0    0 1    0    0    0    0-->5
* 0 1 1 0   0    0    0    0    0 0    1    0    0    0-->6
* 0 1 1 1   0    0    0    0    0 0    0    1    0    0-->7
* 1 0 0 0   0    0    0    0    0 0    0    0    1    0-->8
* 1 0 0 1   0    0    0    0    0 0    0    0    0    1-->9
* Q2
* Q1
* Q0
* Q3
* 4/10 Decoder/Kodçözücü
* Doğruluk
* B3
* B2
* B1
* Q4
* Q5
* Q6
* Q7
* B0
* NAND
* Q8
* Q9
* Vçık
* Vçık
* NAND
* 0V
* 1V
* 2V
* 3V
* 4V
* 5V
* 6V
* 7V
* 8V
* 9V
* B0
* B1
* 0V
* 1V
* 2V
* 3V
* Analog
* Çıkışlar
* Desimal
* Çıkışlar
* Analog
* Çıkışlar
* Binary
* Girişler
* Q2
* Q1
* Q0
* Q3
* 4/16 Decoder/Kodçözücü
* B3
* B2
* B1
* Q4
* Q5
* Q6
* Q7
* B0
* NAND
* Q8
* Q9
* Vçık
* Vçık
* NAND
* 0V
* 1V
* 2V
* 3V
* 4V
* 5V
* 6V
* 7V
* 8V
* 9V
* Analog
* Çıkışlar
* Desimal
* Çıkışlar
* Binary
* Girişler
* Q8
* Q9
* 14V
* 15V
* Q8
* Q9
* 10V
* 11V
* Q8
* Q9
* 12V
* 13V
* Girişler Çıkışlar
* A B C D  Q0 Q1 Q2 Q3 Q4 Q5 Q6 Q7 Q8 Q9 QA QB QC QD QE QF
* 0 0 0 0   1    0    0    0    0 0    0    0    0    0    0    0    0    0    0    0-->0
* 0 0 0 1   0    1    0    0    0 0    0    0    0    0    0    0    0    0    0    0-->1
* 0 0 1 0   0    0    1    0    0 0    0    0    0    0    0    0    0    0    0    0-->2
* 0 0 1 1   0    0    0    1    0 0    0    0    0    0    0    0    0    0    0    0-->3
* 0 1 0 0   0    0    0    0    1 0    0    0    0    0    0    0    0    0    0    0-->4
* 0 1 0 1   0    0    0    0    0 1    0    0    0    0    0    0    0    0    0    0-->5
* 0 1 1 0   0    0    0    0    0 0    1    0    0    0    0    0    0    0    0    0-->6
* 0 1 1 1   0    0    0    0    0 0    0    1    0    0    0    0    0    0    0    0-->7
* 1 0 0 0   0    0    0    0    0 0    0    0    1    0    0    0    0    0    0    0-->8
* 1 0 0 1   0    0    0    0    0 0    0    0    0    1    0    0    0    0    0    0-->9
* 1 0 1 0   0    0    0    0    0 0    0    0    0    0    1    0    0    0    0    0-->A
* 1 0 1 1   0    0    0    0    0 0    0    0    0    0    0    1    0    0    0    0-->B
* 1 1 0 0   0    0    0    0    0 0    0    0    0    0    0    0    1    0    0    0-->C
* 1 1 0 1   0    0    0    0    0 0    0    0    0    0    0    0    0    1    0    0-->D
* 1 1 1 0   0    0    0    0    0 0    0    0    0    0    0    0    0    0    1    0-->E
* 1 1 1 1   0    0    0    0    0 0    0    0    0    1    0    0    0    0    0    1-->F
* Doğruluk
.backanno
.end